# Altium schematic sheet S.SchDoc
size A4
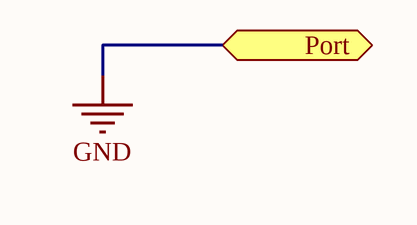
[diagram p0: S.SchDoc]

## Ports
Port

## Nets
GND: port Port